# EAGLE design Flight Controller (EAGLE 9.5.0)
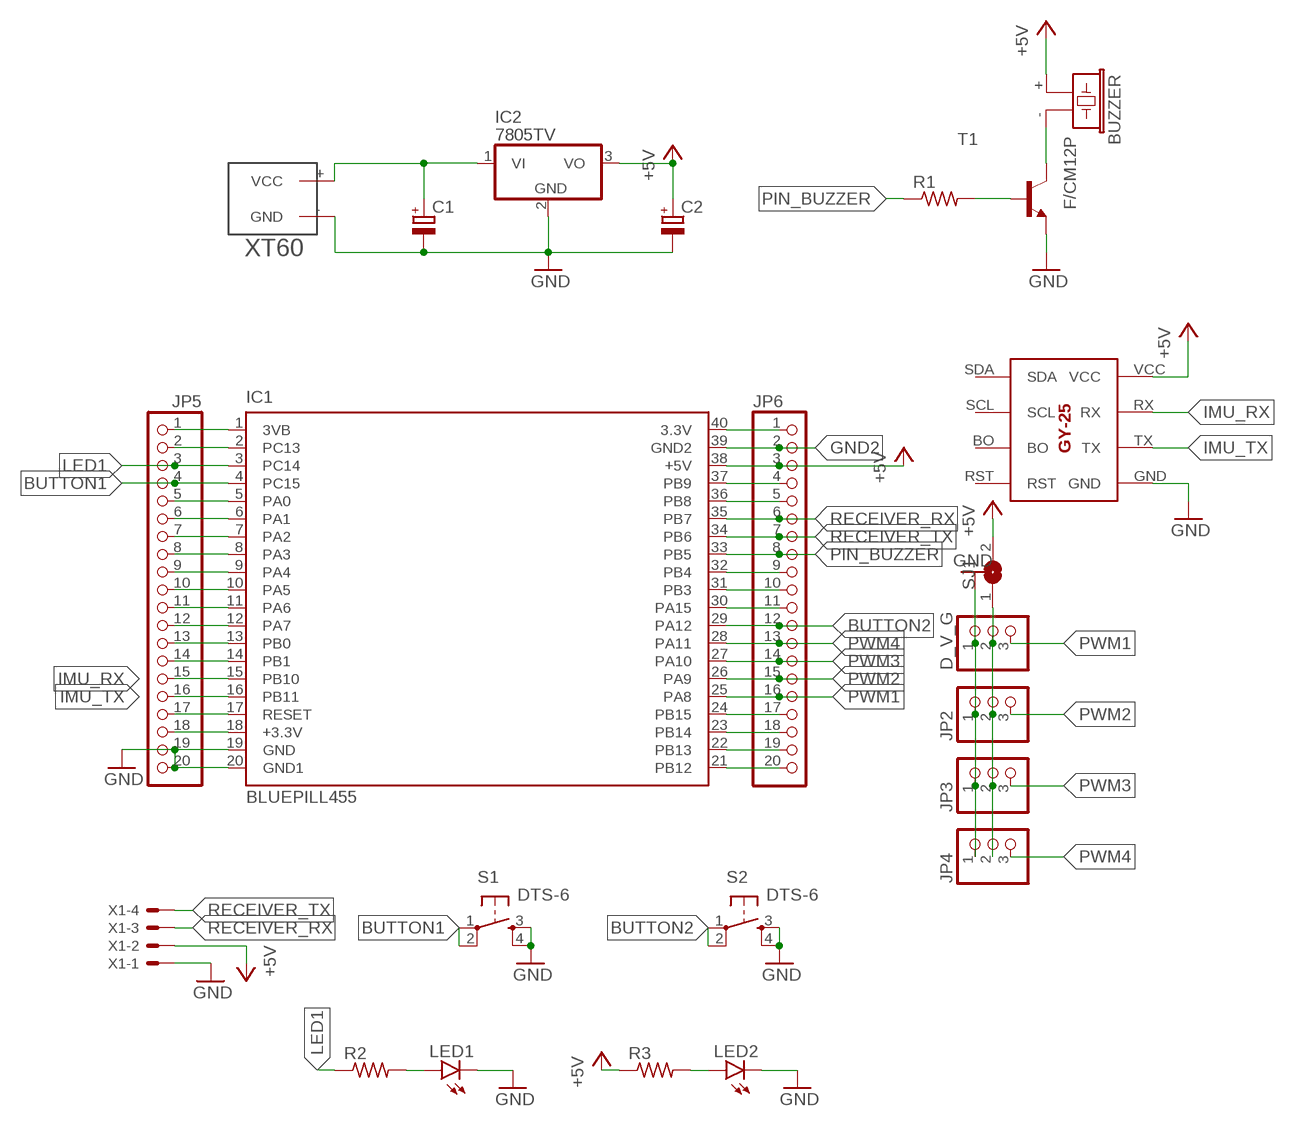
[diagram p0: schematic, sheet 1]

## Parts
BUZZER  F/CM12P  [F/CM12P]
C1  CPOL-EUE2,5-6E  [E2,5-6E]
C2  CPOL-EUE2,5-6E  [E2,5-6E]
D_V_G  PINHD-1X3  [1X03]
GY-1  GY-25GY-25_INV  [GY-25_INV]
IC1  BLUEPILL455  [DIL40]
IC2  7805TV  [TO220V]
JP2  PINHD-1X3  [1X03]
JP3  PINHD-1X3  [1X03]
JP4  PINHD-1X3  [1X03]
JP5  PINHD-1X20  [1X20]
JP6  PINHD-1X20  [1X20]
LED1  LED3MM  [LED3MM]
LED2  LED3MM  [LED3MM]
R1  R-US_M0805  [M0805]
R2  R-US_M0805  [M0805]
R3  R-US_M0805  [M0805]
S1  DTS-6  [DTS-6]
S2  DTS-6  [DTS-6]
SJ1  SJ  [SJ]
T1  -NPN-TO92-EBC  [TO92-EBC]
U$1  XT60  [XT60]
X1  KK-156-4  [KK-156-4]

## Nets
+5V: BUZZER.+ C2.+ GY-1.VCC IC1.38(+5V) IC2.3(VO) JP6.3 R3.1 SJ1.2 X1.2
BUTTON1: IC1.4(PC15) JP5.4 S1.1 S1.2
BUTTON2: IC1.29(PA12) JP6.12 S2.1 S2.2
GND: C1.- C2.- D_V_G.1 GY-1.GND IC1.19(GND) IC1.20(GND1) IC2.2(GND) JP2.1 JP3.1 JP4.1 JP5.19 JP5.20 LED1.K(C) LED2.K(C) S1.3 S1.4 S2.3 S2.4 T1.E U$1.-(GND) X1.1
GND2: IC1.39(GND2) JP6.2
IMU_RX: GY-1.RX IC1.15(PB10) JP5.15
IMU_TX: GY-1.TX IC1.16(PB11) JP5.16
LED1: IC1.3(PC14) JP5.3 R2.1
N$1: C1.+ IC2.1(VI) U$1.+(VCC)
N$2: BUZZER.- T1.C
N$3: IC1.18(+3.3V) JP5.18
N$4: R1.2 T1.B
N$5: IC1.17(RESET) JP5.17
N$6: IC1.14(PB1) JP5.14
N$7: IC1.13(PB0) JP5.13
N$8: IC1.12(PA7) JP5.12
N$9: IC1.11(PA6) JP5.11
N$10: IC1.10(PA5) JP5.10
N$11: IC1.9(PA4) JP5.9
N$12: IC1.8(PA3) JP5.8
N$13: IC1.7(PA2) JP5.7
N$14: IC1.6(PA1) JP5.6
N$15: IC1.5(PA0) JP5.5
N$16: LED1.A R2.2
N$17: LED2.A R3.2
N$18: IC1.2(PC13) JP5.2
N$19: IC1.1(3VB) JP5.1
N$20: IC1.40(3.3V) JP6.1
N$22: IC1.37(PB9) JP6.4
N$23: IC1.36(PB8) JP6.5
N$24: D_V_G.2 JP2.2 JP3.2 JP4.2 SJ1.1
N$25: IC1.32(PB4) JP6.9
N$26: IC1.31(PB3) JP6.10
N$27: IC1.30(PA15) JP6.11
N$29: IC1.24(PB15) JP6.17
N$30: IC1.23(PB14) JP6.18
N$31: IC1.22(PB13) JP6.19
N$32: IC1.21(PB12) JP6.20
PIN_BUZZER: IC1.33(PB5) JP6.8 R1.1
PWM1: D_V_G.3 IC1.25(PA8) JP6.16
PWM2: IC1.26(PA9) JP2.3 JP6.15
PWM3: IC1.27(PA10) JP3.3 JP6.14
PWM4: IC1.28(PA11) JP4.3 JP6.13
RECEIVER_RX: IC1.35(PB7) JP6.6 X1.3
RECEIVER_TX: IC1.34(PB6) JP6.7 X1.4
Unconnected: GY-1.BO GY-1.RST GY-1.SCL GY-1.SDA

## Library data of the parts
BUZZER = buzzer:F/CM12P: BUZZER Source: Buerklin; OC_FARNELL: unknown; OC_NEWARK: unknown
C1 C2 = rcl:CPOL-EU: POLARIZED CAPACITOR, European symbol; SPICEPREFIX: C
D_V_G JP2-JP4 = pinhead:PINHD-1X3: PIN HEADER
GY-1 = GY-25:GY-25
IC1 = STM32BluePill:BLUEPILL: BluePill STM32F108T6 Dev Board Source: http://www.stm32duino.com; 0: x; MF: BluePill; MPN: BluePill; X: 0
IC2 = linear:78*: Positive VOLTAGE REGULATOR Source: http://cache.national.com/ds/LM/LM78L05.pdf http://www.fairchildsemi.com/ds/LM/LM7805.pdf
JP5 JP6 = pinhead:PINHD-1X20: PIN HEADER
LED1 LED2 = led:LED: LED OSRAM: - CHIPLED LG R971, LG N971, LY N971, LG Q971, LY Q971, LO R971, LY R971 LH N974, LH R974 LS Q976, LO Q976, LY Q976 LO Q996 - Hyper CHIPLED LW Q18S LB Q993, LB Q99A, LB R99A - SideLED LS A670, LO A670, LY A670, LG A670, LP A670 LB A673, LV A673, LT A673, LW A673 LH A674 LY A675 LS A676, LA A676, LO A676, LY A676, LW A676 LS A679, LY A679, LG A679 - Hyper Micro SIDELED® LS Y876, LA Y876, LO Y876, LY Y876 LT Y87S - SmartLED LW L88C, LW L88S LB L89C, LB L89S, LG L890 LS L89K, LO L89K, LY L89K LS L896, LA L896, LO L896, LY L896 - TOPLED LS T670, LO T670, LY T670, LG T670, LP T670 LSG T670, LSP T670, LSY T670, LOP T670, LYG T670 LG T671, LOG T671, LSG T671 LB T673, LV T673, LT T673, LW T673 LH T674 LS T676, LA T676, LO T676, LY T676, LB T676, LH T676, LSB T676, LW T676 LB T67C, LV T67C, LT T67C, LS T67K, LO T67K, LY T67K, LW E67C LS E67B, LA E67B, LO E67B, LY E67B, LB E67C, LV E67C, LT E67C LW T67C LS T679, LY T679, LG T679 LS T770, LO T770, LY T770, LG T770, LP T770 LB T773, LV T773, LT T773, LW T773 LH T774 LS E675, LA E675, LY E675, LS T675 LS T776, LA T776, LO T776, LY T776, LB T776 LHGB T686 LT T68C, LB T68C - Hyper Mini TOPLED® LB M676 - Mini TOPLED Santana® LG M470 LS M47K, LO M47K, LY M47K Source: http://www.osram.convergy.de LUXEON: - LUMILED® LXK2-PW12-R00, LXK2-PW12-S00, LXK2-PW14-U00, LXK2-PW14-V00 LXK2-PM12-R00, LXK2-PM12-S00, LXK2-PM14-U00 LXK2-PE12-Q00, LXK2-PE12-R00, LXK2-PE12-S00, LXK2-PE14-T00, LXK2-PE14-U00 LXK2-PB12-K00, LXK2-PB12-L00, LXK2-PB12-M00, LXK2-PB14-N00, LXK2-PB14-P00, LXK2-PB14-Q00 LXK2-PR12-L00, LXK2-PR12-M00, LXK2-PR14-Q00, LXK2-PR14-R00 LXK2-PD12-Q00, LXK2-PD12-R00, LXK2-PD12-S00 LXK2-PH12-R00, LXK2-PH12-S00 LXK2-PL12-P00, LXK2-PL12-Q00, LXK2-PL12-R00 Source: www.luxeon.com KINGBRIGHT: KA-3528ASYC Source: www.kingbright.com
R1-R3 = rcl:R-US_: RESISTOR, American symbol; SPICEPREFIX: R
S1 S2 = switch-tact:DTS-6
SJ1 = jumper:SJ: SMD solder JUMPER
T1 = transistor:*-NPN-: NPN Transistror BF959 corrected 2008.03.06
U$1 = XT60:XT60: XT60
X1 = con-molex:KK-156-4: KK 156 HEADER Source: http://www.molex.com/pdm_docs/sd/026604100_sd.pdf; MF: MOLEX; OC_FARNELL: unknown; OC_NEWARK: unknown

## Board
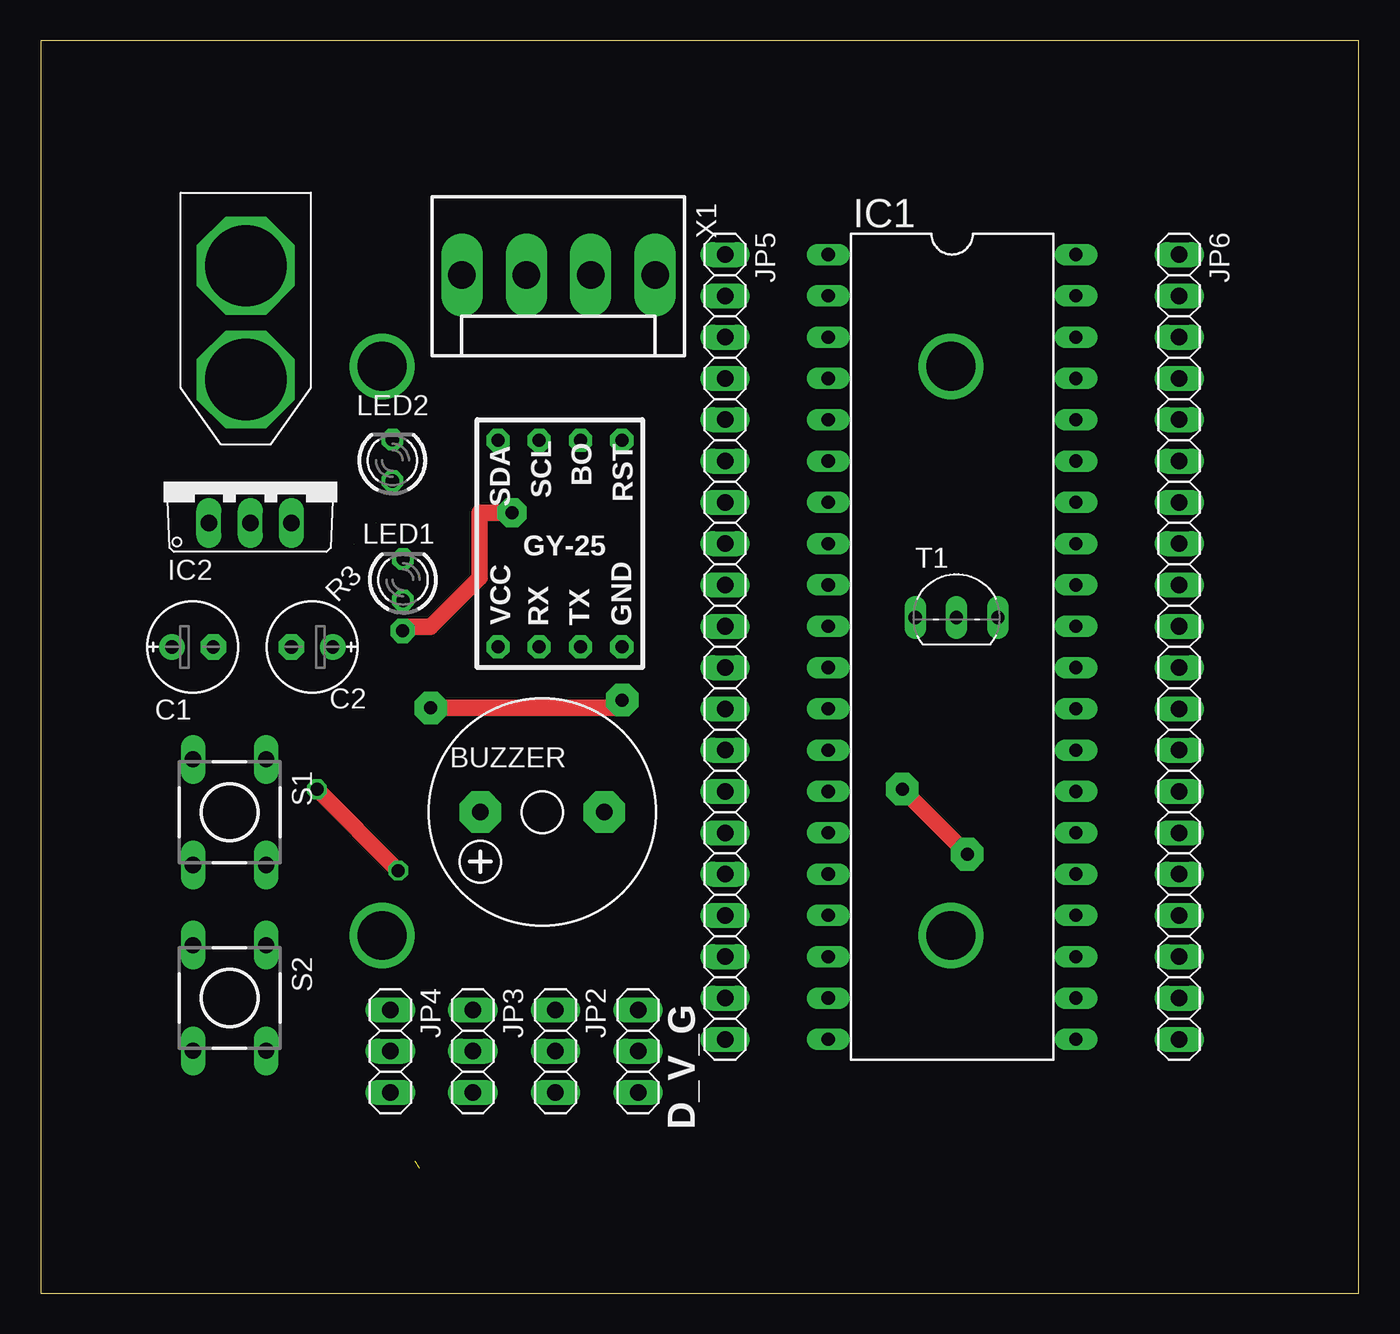
[diagram p1: board, top side]
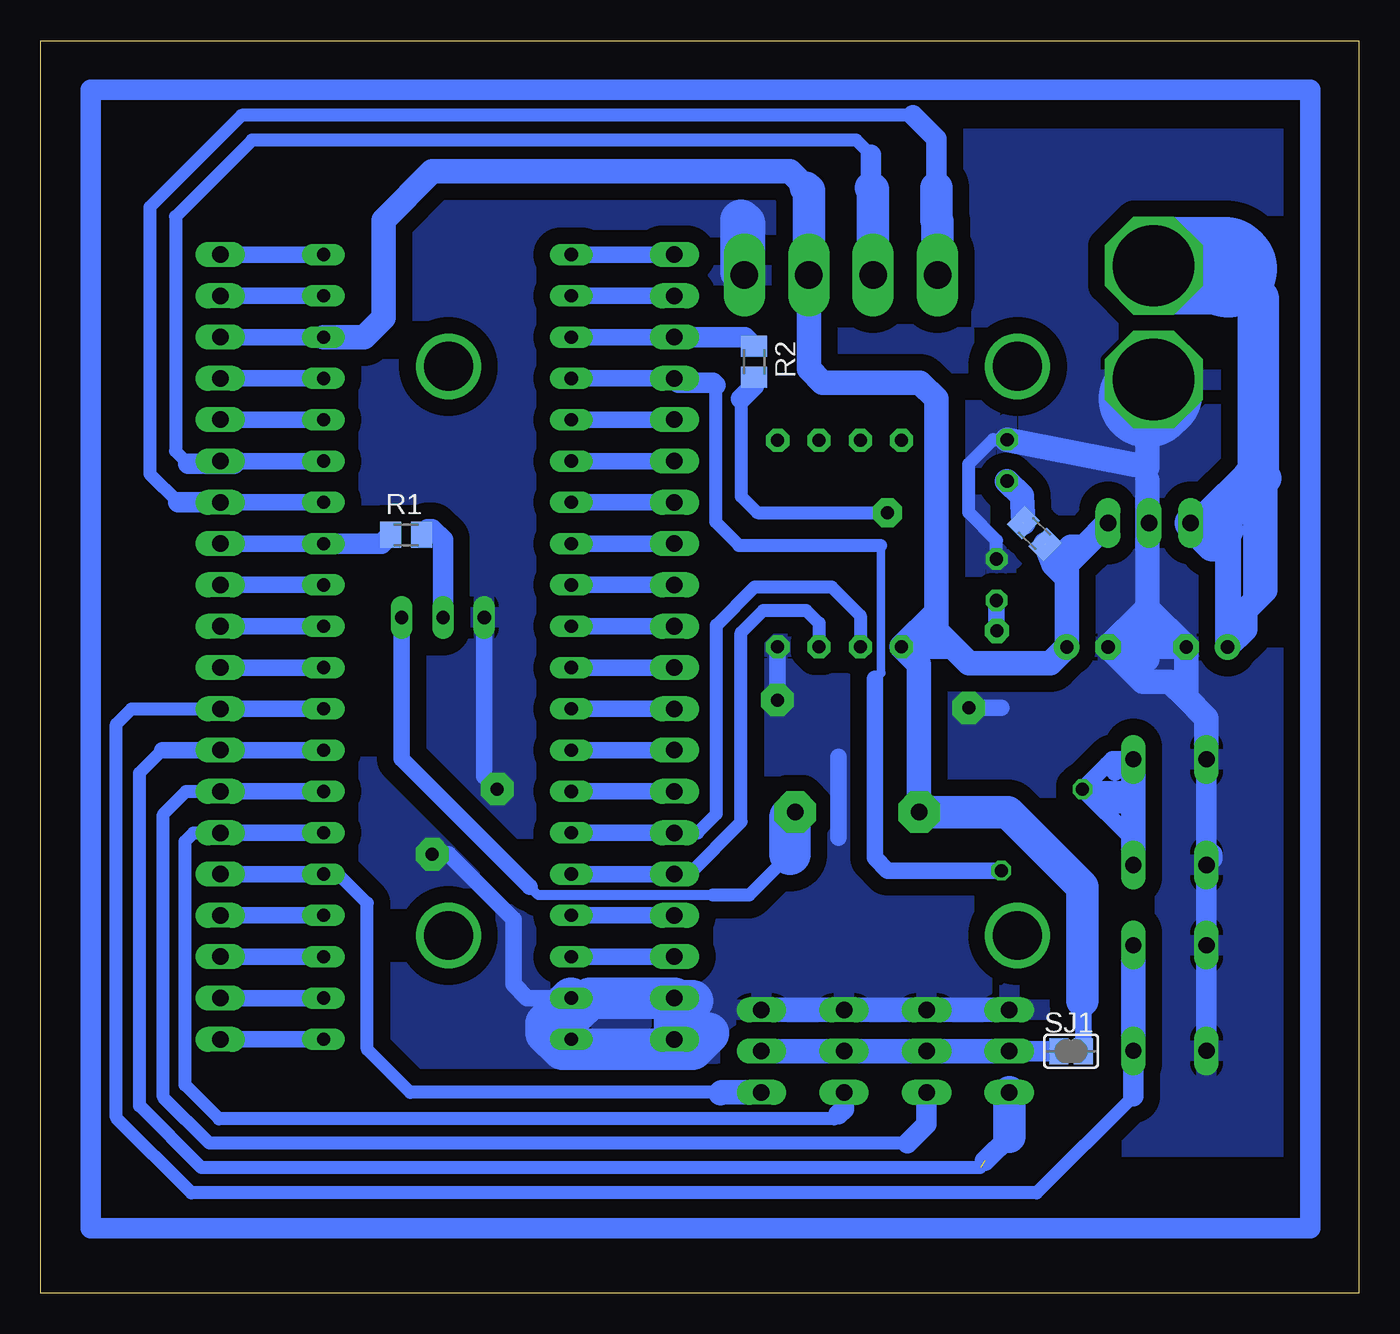
[diagram p2: board, bottom side, seen from below]

Size 81.09 x 77.03 mm. Coordinates in mm from the lower left corner, seen from the top.
Outline: 0,0 81.09,0 81.09,77.03 0,77.03 0,0
Copper layers (1*16): Top 0.035mm / dielectric 1.5mm / Bottom 0.035mm
Design rules "default": minimum track width 6mil, minimum drill 0.35mm, track to track 6mil, track to pad 6mil, pad to pad 6mil, via to via 6mil, smd to smd 6mil, copper to edge 40mil, drill to drill 6mil, minimum pad ring 10mil, minimum via ring 8mil, stop-mask expansion 4mil, vias tented up to drill 0mil, thermal gap 10mil

### Footprints (pad centres in the part's own frame; a part is rotated, then mirrored left to right if it is on the bottom)
F/CM12P = drill 1.016 pad 2.54 octagon: + 3.81,0; - -3.81,0
E2,5-6E = drill 0.813 pad 1.575: + -1.27,0 | drill 0.813 pad 1.575 octagon: - 1.27,0
1X03 = drill 1.016 long: 1 -2.54,0; 2 0,0; 3 2.54,0
GY-25_INV = drill 0.8 pad 1.422 octagon: BO 6.35,-1.27; GND -6.35,-3.81; RST 6.35,-3.81; RX -6.35,1.27; SCL 6.35,1.27; SDA 6.35,3.81; TX -6.35,-1.27; VCC -6.35,3.81
DIL40 = drill 0.813 long: 1 -24.13,-7.62; 2 -21.59,-7.62; 3 -19.05,-7.62; 4 -16.51,-7.62; 5 -13.97,-7.62; 6 -11.43,-7.62; 7 -8.89,-7.62; 8 -6.35,-7.62; 9 -3.81,-7.62; 10 -1.27,-7.62; 11 1.27,-7.62; 12 3.81,-7.62; 13 6.35,-7.62; 14 8.89,-7.62; 15 11.43,-7.62; 16 13.97,-7.62; 17 16.51,-7.62; 18 19.05,-7.62; 19 21.59,-7.62; 20 24.13,-7.62; 21 24.13,7.62; 22 21.59,7.62; 23 19.05,7.62; 24 16.51,7.62; 25 13.97,7.62; 26 11.43,7.62; 27 8.89,7.62; 28 6.35,7.62; 29 3.81,7.62; 30 1.27,7.62; 31 -1.27,7.62; 32 -3.81,7.62; 33 -6.35,7.62; 34 -8.89,7.62; 35 -11.43,7.62; 36 -13.97,7.62; 37 -16.51,7.62; 38 -19.05,7.62; 39 -21.59,7.62; 40 -24.13,7.62
TO220V = drill 1.016 long: 1 -2.54,-2.54; 2 0,-2.54; 3 2.54,-2.54
1X20 = drill 1.016 long: 1 -24.13,0; 2 -21.59,0; 3 -19.05,0; 4 -16.51,0; 5 -13.97,0; 6 -11.43,0; 7 -8.89,0; 8 -6.35,0; 9 -3.81,0; 10 -1.27,0; 11 1.27,0; 12 3.81,0; 13 6.35,0; 14 8.89,0; 15 11.43,0; 16 13.97,0; 17 16.51,0; 18 19.05,0; 19 21.59,0; 20 24.13,0
LED3MM = drill 0.813 octagon: A -1.27,0; K 1.27,0
M0805 = smd 1.3 x 1.6: 1 -0.95,0; 2 0.95,0
DTS-6 = drill 1 long: 1 -3.25,2.25; 2 3.25,2.25; 3 -3.25,-2.25; 4 3.25,-2.25
SJ = smd 1.168 x 1.6: 1 -0.762,0; 2 0.762,0
TO92-EBC = drill 0.813 long: B 0,-1.27; C 2.54,-1.27; E -2.54,-1.27
XT60 = drill 5 octagon: + 4.5,0; - 11.5,0
KK-156-4 = drill 1.7 pad 2.184 long: 1 -5.94,0; 2 -1.98,0; 3 1.98,0; 4 5.94,0

### Placement (x,y rotation side)
BUZZER  30.86,29.59 180 top
C1  9.35,39.75 0 top
C2  16.7,39.75 180 top
D_V_G  36.75,14.89 270 top
GY-1  31.94,46.1 90 top
IC1  56.07,39.75 270 top
IC2  12.89,49.91 0 top
JP2  31.67,14.89 270 top
JP3  26.59,14.89 270 top
JP4  21.51,14.89 270 top
JP5  42.1,39.75 270 top
JP6  70.04,39.75 270 top
LED1  22.29,43.88 90 top
LED2  21.64,51.22 90 top
R1  58.61,46.64 0 bottom
R2  37.2,57.29 270 bottom
R3  19.96,46.72 135 bottom
S1  11.62,29.59 270 top
S2  11.62,18.16 270 top
SJ1  17.7,14.89 0 bottom
T1  56.34,42.83 0 top
U$1  12.62,67.69 270 top
X1  31.86,62.61 180 top

### Tracks (layer width: path | path; a pad name or v marks a point on that pad's centre or on a via)
+5V  (1 unrouted)
  Bottom 1.016: JP6.3 IC1.38 | SJ1.2 16.94,17.94 17,18
  Bottom 1.5: BUZZER.+ 27.05,38.67 GY-1.VCC | IC2.3 16.9,45.9 | 16.9,45.9 17.97,44.83 | 17.97,44.83 17.97,44 | 17.97,44 C2.+ 18.97,38.75 24,38.75 25,39.75 | 18.8,44.83 17.97,44.83 | R3.1 18.8,44.83 | 17.97,44 18.8,44.83 | 18.8,44.83 17.73,45.9 16.9,45.9 | 34,68 35,69 57,69 60,66 60,60 61.2,58.8 IC1.38 | 25,39.75 26,39.75 | 26,39.75 GY-1.VCC | X1.2 33.84,56.84 33,56 27,56 26,55 26,41.88 | 26,41.88 26,40.75 | 26,40.75 26,39.75 | GY-1.VCC 26,41.88 | 25,39.75 26,40.75
  Bottom 2: X1.2 33.84,67.84 34,68 | 17,18 17,25 21.59,29.59 BUZZER.+
BUTTON1  (via drill 0.8)
  Top 1.016: v22,26 v17,31
  Bottom 0.508: 29.41,46 29.41,38.16
  Bottom 0.61: 29.41,38.16 29.78,37.79
  Bottom 0.813: 39.57,55.83 39.57,47.43 38.14,46 29.41,46
  Bottom 1.016: IC1.4 JP5.4 | 29.78,37.79 29.78,26.78 29,26 v22,26 | v17,31 13.87,31 | S1.1 15.16,32.84 15.5,32.5 | 15.5,32.5 v17,31 | 15.5,32.5 15,32 | v17,31 16,30 13.87,30 | v17,31 14,28 13.87,28
  Bottom 1.27: JP5.4 41.84,56 39.74,56 39.57,55.83
  Bottom 1.5: S1.2 13.87,28 13.87,30 13.87,31 S1.1
BUTTON2
  Bottom 0.813: JP6.12 75.5,35.94 76.44,35 76.44,10.8 71.81,6.17 19.82,6.17 13.87,12.13
  Bottom 1.016: JP6.12 IC1.29
  Bottom 1.27: S2.2 13.87,12.13
  Bottom 1.5: S2.2 S2.1
GND  (via drill 0.8 pad 2)
  Top 1.016: v53,31 v57,27 | v35.77,36.48 35.29,36 v24,36
  Bottom 0.813: LED1.K 22.29,46.29 24,48 24,51 22.51,52.49 LED2.K
  Bottom 1.016: IC1.19 JP5.19 | IC1.19 48.45,17 IC1.20 | T1.E 53.8,31.8 v53,31 | v57,27 56,27 52,23 52,19 51.16,18.16 IC1.19 | 32,28 32,33 | 36.02,36.23 v35.77,36.48 35.77,39.73 GY-1.GND | v24,36 22,36
  Bottom 1.27: S2.4 S2.3 S1.4 | S1.4 9.37,26.63 9,27 9,26.71 S1.4 | S1.4 S1.3
  Bottom 1.5: JP4.1 JP3.1 JP2.1 D_V_G.1 | 13,55 13,50.79 LED2.K | 13,50 13,47.48 IC2.2 13,47.26 13,42.13 | 13,42.13 13,42 | 13,42 13,40 | 13,40 12.75,39.75 | C1.- 12.75,39.75 | 13,40 13.25,39.75 C2.- | C2.- 13.18,42 13,42 | C1.- 13,42.13 | S1.3 9.37,35.37 10.62,36.62 | C1.- 10.62,36.62 | 10.62,36.62 11.62,37.62 13.3,37.62 C2.- | 12.75,39.75 13,39.5 13,39
  Bottom 2.54: JP5.19 JP5.20 | JP5.19 47.29,18.16 48.45,17 | IC1.19 50,16.61 50,16 49,15 41,15 40,16 | JP5.19 41.94,18 41,18 | X1.1 37.8,65.8 38,66 38,62.81 X1.1
  Bottom 6: U$1.- 12.62,55.38 13,55
  pour Bottom (isolate 1.016): 4,71 73,71 73,9 4,9
GND2
  Bottom 1.016: IC1.39 JP6.2
IMU_RX
  Bottom 0.813: JP5.15 40.68,28.32 39.52,29.48 39.52,41.09 37.17,43.44 32.44,43.44 30.67,41.67 GY-1.RX
  Bottom 1.016: IC1.15 JP5.15
IMU_TX
  Bottom 0.813: JP5.16 41.22,25.78 38,29 38,40.63 36.63,42 34,42 33.21,41.21 GY-1.TX
  Bottom 1.016: IC1.16 JP5.16
LED1
  Bottom 1.016: IC1.3 JP5.3
  Bottom 1.27: R2.1 37.76,58.8 JP5.3
N$1
  Bottom 1.27: 6.5,42.5 6.5,47.5 7,48 7,49
  Bottom 1.5: 8.08,42 C1.+ 7,40.83 7,42 6.5,42.5 5.77,43.23 5.77,50.12 | 9,48 8.08,47.08 8.08,46.92 8.08,42 | 8.08,42 8,42.08 8,48 | 6.53,50.12 6.53,50.79
  Bottom 2: 5.77,50.12 6.53,50.12 6.88,50.12 9,48 | 8.08,46.92 9,46 10.35,47.35 IC2.1
  Bottom 2.54: 8.02,63 6.18,61.16 6.18,50.47 6.53,50.12
  Bottom 6: U$1.+ 8.21,63.19 8.02,63
N$2
  Bottom 0.61: 39.74,24.48 50.48,24.48 51,25
  Bottom 0.813: 35,27 37.52,24.48 39.74,24.48
  Bottom 1.016: 51,25 58.88,32.88 T1.C
  Bottom 2.54: BUZZER.- 35,29.26 35,27
N$3
  Bottom 1.016: IC1.18 JP5.18
N$4
  Bottom 1.27: T1.B 56.34,46.34 57,47 57.3,47 R1.2
N$5
  Bottom 1.016: IC1.17 JP5.17
N$6
  Bottom 1.016: IC1.14 JP5.14
N$7
  Bottom 1.016: IC1.13 JP5.13
N$8
  Bottom 1.016: IC1.12 JP5.12
N$9
  Bottom 1.016: IC1.11 JP5.11
N$10
  Bottom 1.016: IC1.10 JP5.10
N$11
  Bottom 1.016: IC1.9 JP5.9
N$12
  Bottom 1.016: IC1.8 JP5.8
N$13
  Bottom 1.016: IC1.7 JP5.7
N$14
  Bottom 1.016: IC1.6 JP5.6
N$15
  Bottom 1.016: IC1.5 JP5.5
N$16  (via drill 0.8 pad 1.5, 0.8 pad 1.8)
  Top 1.016: v22.27,40.73 22.53,41 24,41 27,44 27,48 v29,48
  Bottom 0.813: 38,55 38,49 37,48 v29,48
  Bottom 1.016: LED1.A 22.29,40.78 22.3,40.77 v22.27,40.73
  Bottom 1.27: R2.2 37.2,55.8 38,55
N$17  (1 unrouted)
  Bottom 1.5: LED2.A 20.73,49.04 R3.2
N$18
  Bottom 1.016: JP5.2 IC1.2
N$19
  Bottom 1.016: JP5.1 IC1.1
N$20
  Bottom 1.016: IC1.40 JP6.1
N$21
  Bottom 1.27: 3,74 3,4 78,4 78,74 3,74
N$22
  Bottom 1.016: JP6.4 IC1.37
N$23
  Bottom 1.016: JP6.5 IC1.36
N$24
  Bottom 1.27: JP4.2 SJ1.1
  Bottom 1.5: JP4.2 JP3.2 JP2.2 D_V_G.2
N$25
  Bottom 1.016: JP6.9 IC1.32
N$26
  Bottom 1.016: JP6.10 IC1.31
N$27
  Bottom 1.016: JP6.11 IC1.30
N$28  (via drill 3)
  other vias: 21,22
N$29
  Bottom 1.016: JP6.17 IC1.24
N$30
  Bottom 1.016: JP6.18 IC1.23
N$31
  Bottom 1.016: JP6.19 IC1.22
N$32
  Bottom 1.016: JP6.20 IC1.21
N$33  (via drill 3)
  other vias: 21,57
N$34  (via drill 3)
  other vias: 56,57
N$35  (via drill 3)
  other vias: 56,22
PIN_BUZZER
  Bottom 1.016: JP6.8 IC1.33
  Bottom 1.27: IC1.33 60.1,46.1 R1.1
PWM1
  Bottom 0.813: 39.2,12.35 58.35,12.35 61,15 61,24 62.78,25.78 IC1.25
  Bottom 1.016: JP6.16 IC1.25
  Bottom 1.5: D_V_G.3 39.2,12.35 39.26,12.29
PWM2
  Bottom 0.813: 32,11 32.27,10.73 70.12,10.73 72.21,12.82 72.21,27.79 71.68,28.32 JP6.15
  Bottom 1.016: JP6.15 IC1.26
  Bottom 1.27: JP2.3 31.67,11.33 32,11
PWM3
  Bottom 0.813: 27.77,9.23 70.7,9.23 73.54,12.07 73.54,29.46 72.14,30.86 JP6.14
  Bottom 1.016: JP6.14 IC1.27
  Bottom 1.27: JP3.3 26.59,10.41 27.77,9.23
PWM4  (1 unrouted)
  Bottom 0.813: 23.29,7.73 71.2,7.73 75,11.53 75,32 73.6,33.4
  Bottom 1.016: IC1.28 JP6.13 73.6,33.4
  Bottom 1.27: 21.51,9.64 23,8.15
  Bottom 2: JP4.3 21.51,9.64
RECEIVER_RX
  Bottom 0.813: 30,70 30.91,70.91 68.09,70.91 72.79,66.21 72.79,51.79 72,51
  Bottom 1.016: JP6.6 69,51.18 IC1.35
  Bottom 1.27: 30,68 30,70 | 72,51 69.18,51 69,51.18
  Bottom 2: X1.3 29.88,67.88 30,68
RECEIVER_TX
  Bottom 0.813: 27.43,72.43 68.73,72.43 74.37,66.79 74.37,50.37 72.64,48.64
  Bottom 1.016: JP6.7 IC1.34
  Bottom 1.27: 26,68 26,71 27.43,72.43 | 72.64,48.64 JP6.7
  Bottom 2: X1.4 25.92,65.92 26,66 26,68

### Text on the board
tSilk: Receiver | Tx | Rx | 5V | GND | 12V | Pwr_Ind | LED_Ind | STM32F103 | 7805 | Buzzer | BUTTON1 | STM32F103 | G | BUTTON2 | 5V | D | Pwm 4 | Pwm 3 | Pwm 2 | Pwm 1 | SKY_Hunter 1.0 | RAP_Corp